# EAGLE design ld100v1 (EAGLE 9.6.2)
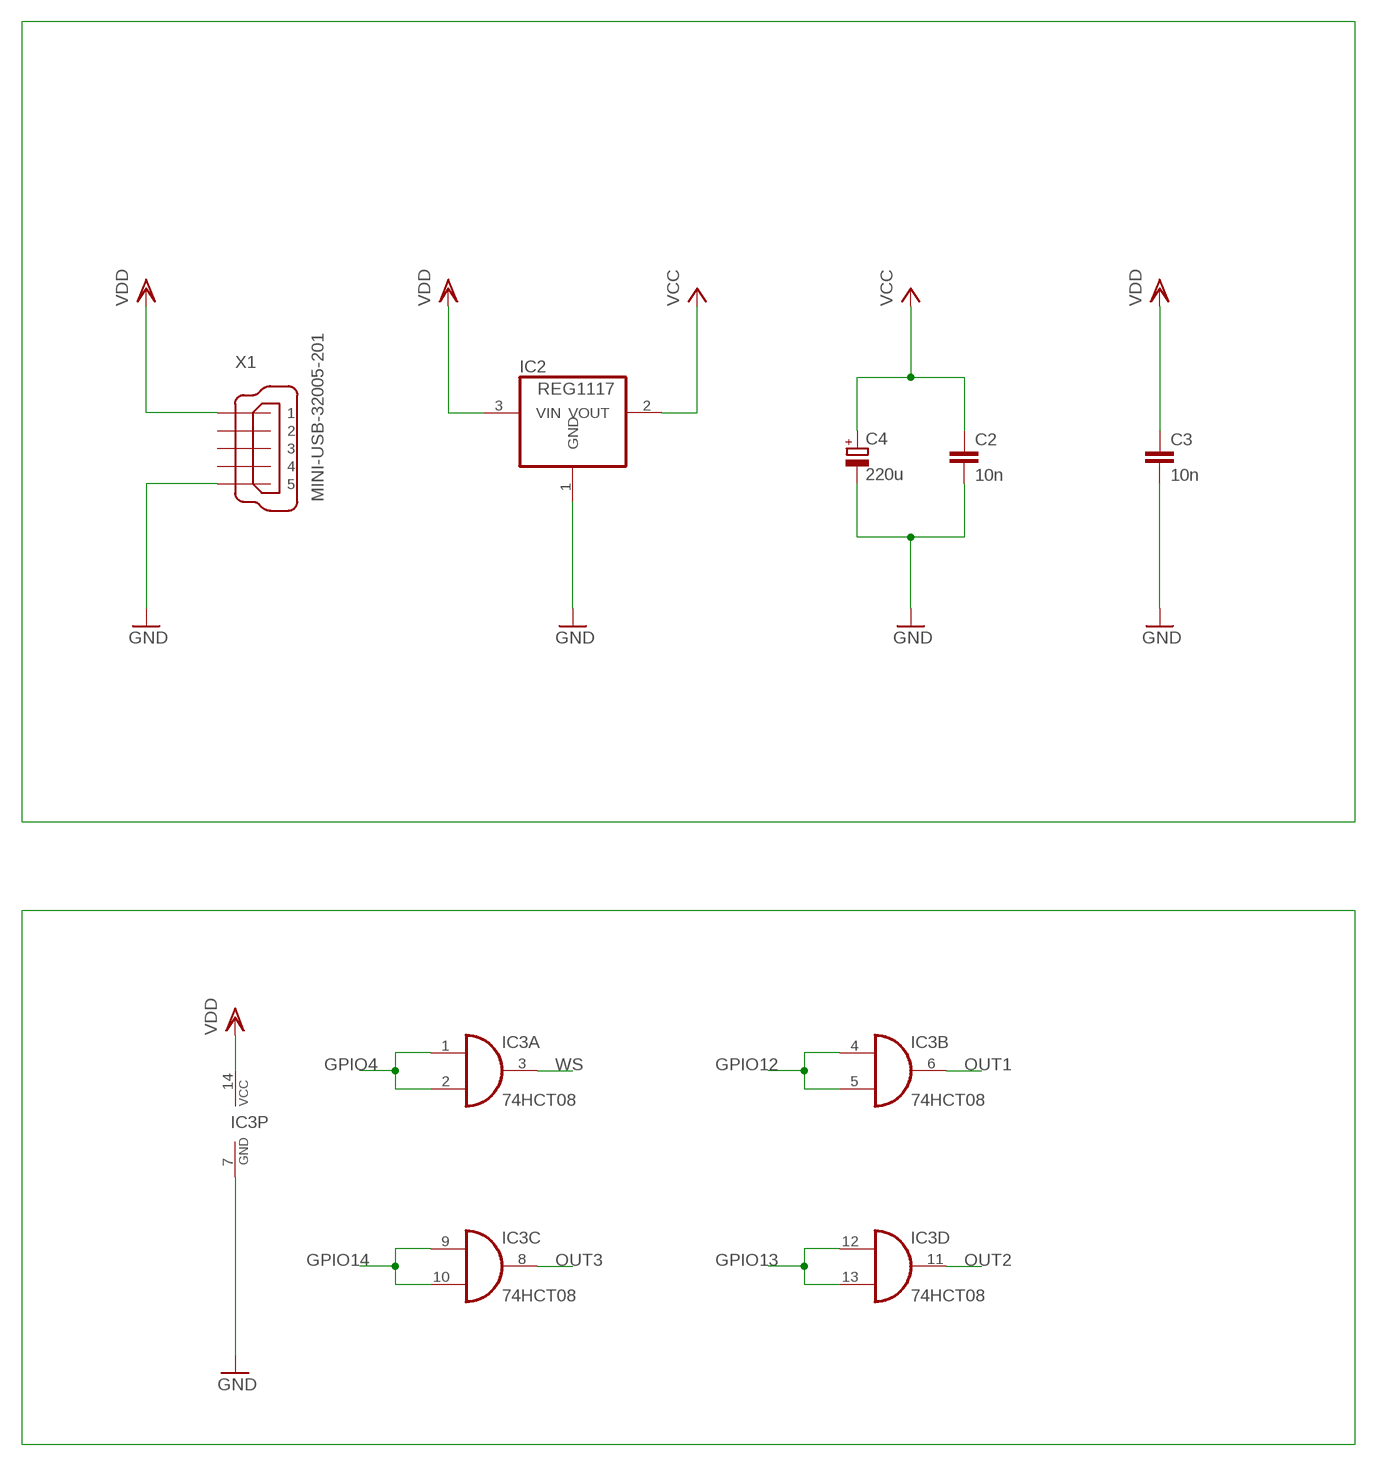
[diagram p0: schematic, sheet 1, part 1 of 2]
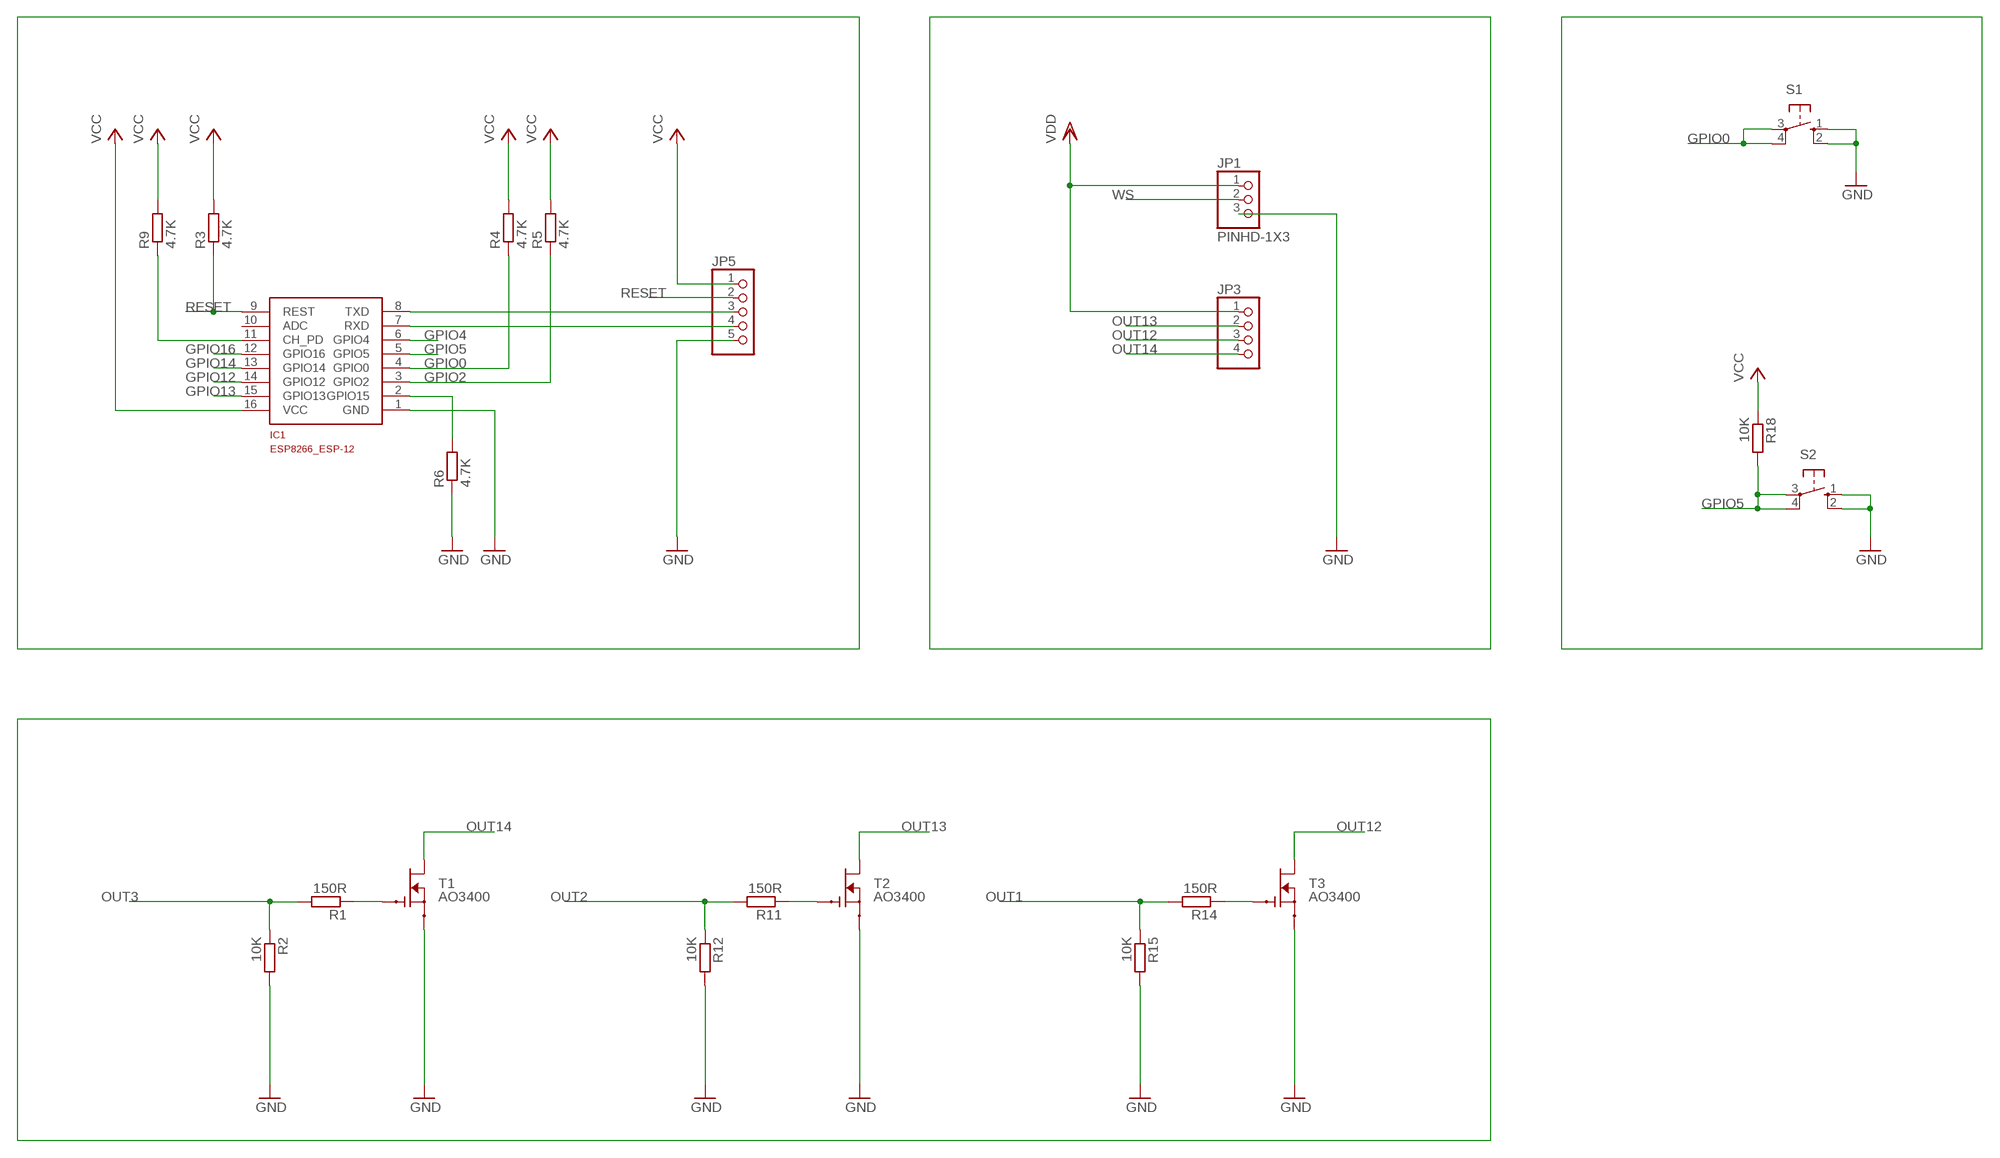
[diagram p1: schematic, sheet 1, part 2 of 2]

## Parts
C2  10n  C-EUC1206  [C1206]
C3  10n  C-EUC1206  [C1206]
C4  220u  CPOL-EUUD-6,3X8,8  [UD-6,3X5,8_NICHICON]
IC1  ESP8266_ESP-12  [ESP8266-ESP12]
IC2  REG1117  [SOT223]
IC3  74HCT08  74AC08D  [SO14]
JP1  PINHD-1X3  [1X03]
JP3  PINHD-1X4  [1X04]
JP5  PINHD-1X5  [1X05]
R1  150R  R-EU_R1206  [R1206]
R2  10K  R-EU_R1206  [R1206]
R3  4.7K  R-EU_R1206  [R1206]
R4  4.7K  R-EU_R1206  [R1206]
R5  4.7K  R-EU_R1206  [R1206]
R6  4.7K  R-EU_R1206  [R1206]
R9  4.7K  R-EU_R1206  [R1206]
R11  150R  R-EU_R1206  [R1206]
R12  10K  R-EU_R1206  [R1206]
R14  150R  R-EU_R1206  [R1206]
R15  10K  R-EU_R1206  [R1206]
R18  10K  R-EU_R1206  [R1206]
S1  10-XX  [B3F-10XX]
S2  10-XX  [B3F-10XX]
T1  AO3400  [SOT23]
T2  AO3400  [SOT23]
T3  AO3400  [SOT23]
X1  MINI-USB-32005-201  [32005-201]

## Nets
GND: C2.2 C3.2 C4.- IC1.1(GND) IC2.1(GND) IC3.7(P:GND) JP1.3 JP5.5 R2.2 R6.1 R12.2 R15.2 S1.1(S) S1.2(S1) S2.1(S) S2.2(S1) T1.2(S) T2.2(S) T3.2(S) X1.5
GPIO0: IC1.4(GPIO0) R4.1 S1.3(P) S1.4(P1)
GPIO2: IC1.3(GPIO2) R5.1
GPIO4: IC1.6(GPIO4) IC3.1(A:I0) IC3.2(A:I1)
GPIO5: IC1.5(GPIO5) R18.2 S2.3(P) S2.4(P1)
GPIO12: IC1.14(GPIO12) IC3.4(B:I0) IC3.5(B:I1)
GPIO13: IC1.15(GPIO13) IC3.12(D:I0) IC3.13(D:I1)
GPIO14: IC1.13(GPIO14) IC3.9(C:I0) IC3.10(C:I1)
GPIO16: IC1.12(GPIO16)
N$1: IC1.8(TXD) JP5.3
N$2: IC1.7(RXD) JP5.4
N$4: IC1.11(CH_PD) R9.1
N$6: IC1.2(GPIO15) R6.2
N$8: R1.1 T1.1(G)
N$11: R11.1 T2.1(G)
N$13: R14.1 T3.1(G)
OUT1: IC3.6(B:O) R14.2 R15.1
OUT2: IC3.11(D:O) R11.2 R12.1
OUT3: IC3.8(C:O) R1.2 R2.1
OUT12: JP3.3 T3.3(D)
OUT13: JP3.2 T2.3(D)
OUT14: JP3.4 T1.3(D)
RESET: IC1.9(REST) JP5.2 R3.1
VCC: C2.1 C4.+ IC1.16(VCC) IC2.2(VOUT) JP5.1 R3.2 R4.2 R5.2 R9.2 R18.1
VDD: C3.1 IC2.3(VIN) IC3.14(P:VCC) JP1.1 JP3.1 X1.1
WS: IC3.3(A:O) JP1.2
Unconnected: IC1.10(ADC) X1.2 X1.3 X1.4

## Library data of the parts
C2 C3 = rcl:C-EU: CAPACITOR, European symbol; SPICEPREFIX: C
C4 = rcl:CPOL-EU: POLARIZED CAPACITOR, European symbol; SPICEPREFIX: C
IC1 = ESP8266-ESP12:ESP8266_ESP-12
IC2 = burr-brown:REG1117: 800mA and 1A Low Dropout (LDO) Positive Regulator 1.8V, 2.5V, 2.85V, 3.3V, 5V, and Adj; MPN: REG1117; OC_FARNELL: 1097566; OC_NEWARK: 14P6981
IC3 = 74xx-eu:74*08: Quad 2-input AND gate
JP1 = Connector:PINHD-1X3: PIN HEADER; CATEGORY: CONNECTOR; SUB-CATEGORY: PIN-HEADER
JP3 = pinhead:PINHD-1X4: PIN HEADER
JP5 = pinhead:PINHD-1X5: PIN HEADER
R1-R6 R9 R11 R12 R14 R15 R18 = rcl:R-EU_: RESISTOR, European symbol; SPICEPREFIX: R
S1 S2 = switch-omron:10-XX: OMRON SWITCH; MPN: B3F-1000; OC_FARNELL: 176432; OC_NEWARK: 36M3542
T1-T3 = AO3400:AO3400; AVAILABILITY: Unavailable; DESCRIPTION: N-Channel 30V 5.8A _Ta_ 1.4W _Ta_ Surface Mount SOT-23-3; MF: Alpha &; MP: AO3400; PACKAGE: SOT-23-3 Alpha &amp; Omega Semiconductor; PRICE: None
X1 = con-cypressindustries:MINI-USB-: MINI USB-B Conector Source: www.cypressindustries.com; OC_FARNELL: unknown; OC_NEWARK: unknown

## Board
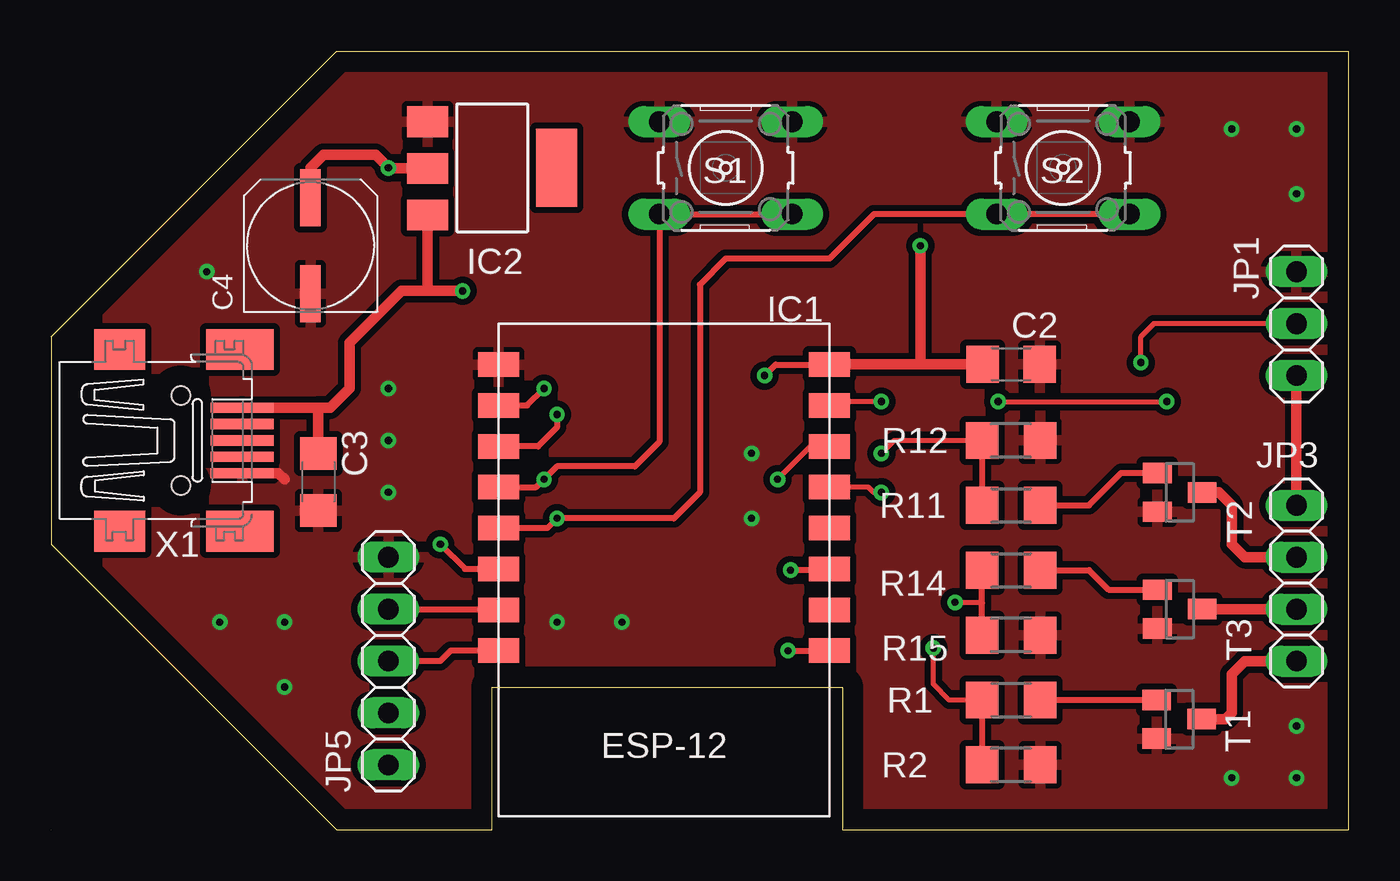
[diagram p2: board, top side]
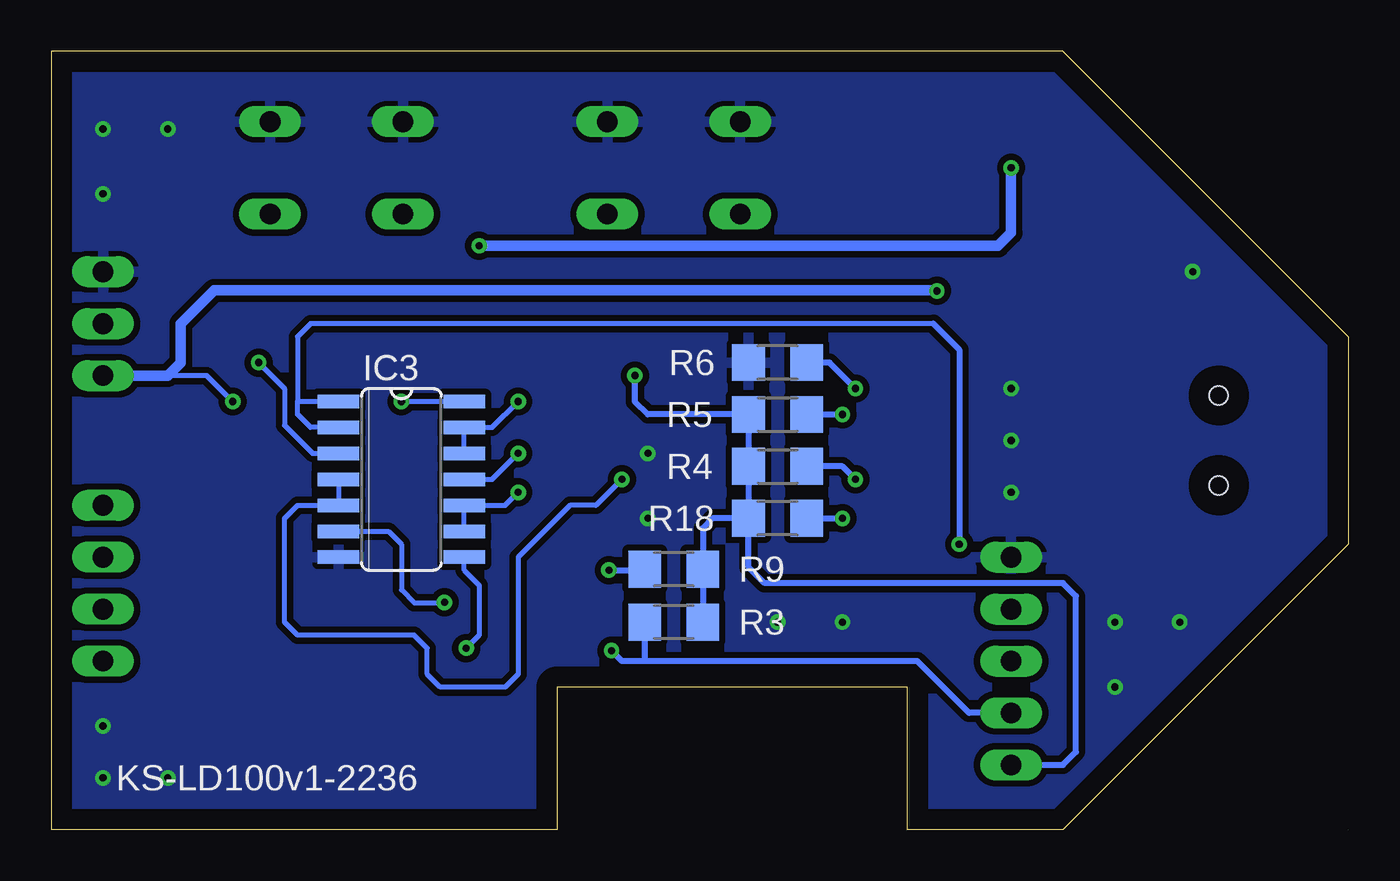
[diagram p3: board, bottom side, seen from below]

Size 63.5 x 38.1 mm. Coordinates in mm from the lower left corner, seen from the top.
Outline: 0,0 0.01,0
Outline: 0,24.13 0,13.97 13.97,0 21.59,0 21.59,6.99 38.73,6.99 38.73,0 63.5,0 63.5,38.1 13.97,38.1 0,24.13
Copper layers (1*16): Top 0.035mm / dielectric 1.5mm / Bottom 0.035mm
Design rules "default *": minimum track width 10mil, minimum drill 0.35mm, track to track 10mil, track to pad 10mil, pad to pad 10mil, via to via 10mil, smd to smd 10mil, copper to edge 40mil, drill to drill 12mil, minimum pad ring 10mil, minimum via ring 8mil, stop-mask expansion 4mil, vias tented up to drill 0mil, thermal gap 10mil

### Footprints (pad centres in the part's own frame; a part is rotated, then mirrored left to right if it is on the bottom)
C1206 = smd 1.6 x 1.8: 1 -1.4,0; 2 1.4,0
UD-6,3X5,8_NICHICON = smd 2.8 x 1: + 2.35,0; - -2.35,0
ESP8266-ESP12 = smd 2 x 1.2: 1 16.2,2; 2 16.2,4; 3 16.2,6; 4 16.2,8; 5 16.2,10; 6 16.2,12; 7 16.2,14; 8 16.2,16; 9 0,16; 10 0,14; 11 0,12; 12 0,10; 13 0,8; 14 0,6; 15 0,4; 16 0,2
SOT223 = smd 1.499 x 2.007: 1 -2.261,-3.15; 2 0.025,-3.15; 3 2.311,-3.15 | smd 3.81 x 2.007: 4 0,3.15
SO14 = smd 0.66 x 2.032: 1 -3.81,-3.073; 2 -2.54,-3.073; 3 -1.27,-3.073; 4 0,-3.073; 5 1.27,-3.073; 6 2.54,-3.073; 7 3.81,-3.073; 8 3.81,3.073; 9 2.54,3.073; 10 1.27,3.073; 11 0,3.073; 12 -1.27,3.073; 13 -2.54,3.073; 14 -3.81,3.073
1X03 = drill 1.016 long: 1 -2.54,0; 2 0,0; 3 2.54,0
1X04 = drill 1.016 long: 1 -3.81,0; 2 -1.27,0; 3 1.27,0; 4 3.81,0
1X05 = drill 1.016 long: 1 -5.08,0; 2 -2.54,0; 3 0,0; 4 2.54,0; 5 5.08,0
R1206 = smd 1.6 x 1.803: 1 -1.422,0; 2 1.422,0
B3F-10XX = drill 1.016 long: 1 -3.251,2.261; 2 3.251,2.261; 3 -3.251,-2.261; 4 3.251,-2.261
SOT23 = smd 1 x 1.4: 1 -0.95,-1.1; 2 0.95,-1.1; 3 0,1.1
32005-201 = smd 3.1 x 0.5: 1 3,1.6; 2 3,0.8; 3 3,0; 4 3,-0.8; 5 3,-1.6 | smd 2.5 x 2: M1 -3,-4.45; M2 -3,4.45 | smd 3.3 x 2: M3 2.9,4.45; M4 2.9,-4.45 | hole 0.9: 0,2.2; 0,-2.2

### Placement (x,y rotation side)
C2  46.99,22.78 0 top
C3  13.08,17.02 270 top
C4  12.7,28.57 90 top
IC1  38.1,24.77 180 top
IC2  21.59,32.38 270 top
IC3  46.35,17.14 270 bottom
JP1  60.96,24.77 90 top
JP3  60.96,12.06 270 top
JP5  16.51,8.26 90 top
R1  46.99,6.35 180 top
R2  46.99,3.17 0 top
R3  33.02,10.16 0 bottom
R4  27.94,17.78 180 bottom
R5  27.94,20.32 180 bottom
R6  27.94,22.86 0 bottom
R9  33.02,12.75 0 bottom
R11  46.99,15.88 180 top
R12  46.99,19.05 0 top
R14  46.99,12.7 180 top
R15  46.99,9.53 0 top
R18  27.94,15.24 0 bottom
S1  33.02,32.38 0 top
S2  49.53,32.38 0 top
T1  55.22,5.41 270 top
T2  55.24,16.51 270 top
T3  55.24,10.79 270 top
X1  6.35,19.05 0 top

### Tracks (layer width: path | path; a pad name or v marks a point on that pad's centre or on a via)
GND  (via drill 0.35)
  Top 0.508: X1.5 11.12,17.45 11.43,17.14
  other vias: 8.26,10.16 7.62,27.3 16.51,16.51 16.51,19.05 16.51,21.59 60.96,31.11 60.96,34.29 57.78,34.29 60.96,5.08 60.96,2.54 57.78,2.54 11.43,10.16 11.43,6.99 34.29,18.41 34.29,15.24 24.77,10.16 27.94,10.16
  pour Top (isolate 0.305): 62.87,37.47 62.87,0.64 39.37,0.64 39.37,7.62 20.95,7.62 20.95,0.64 13.97,0.64 0.64,13.97 0.64,14.61 0.64,24.13 13.97,37.47
  pour Bottom (isolate 0.305): 14.61,37.47 62.87,37.47 62.87,0.64 39.37,0.64 39.37,7.62 20.95,7.62 20.95,0.64 13.97,0.64 0.64,13.97 0.64,23.5
GPIO0  (via drill 0.35)
  Top 0.305: S1.4 S1.3 29.77,18.97 28.57,17.78 24.77,17.78 v24.13,17.14 23.75,16.77 IC1.4
  Bottom 0.305: v24.13,17.14 24.77,17.78 R4.1
GPIO2  (via drill 0.35)
  Top 0.305: v24.77,20.32 24.77,19.68 23.84,18.77 IC1.3
  Bottom 0.305: R5.1 v24.77,20.32
GPIO4  (via drill 0.35)
  Top 0.305: v19.05,13.97 20.25,12.77 IC1.6
  Bottom 0.254: IC3.2 50.8,19.68 51.44,20.32 51.44,20.95 | IC3.1 51.44,20.95 | 20.32,24.77 50.8,24.77 51.44,24.13 51.44,20.95
  Bottom 0.305: 20.32,24.77 19.05,23.5 v19.05,13.97
GPIO5  (via drill 0.35)
  Top 0.305: S2.4 S2.3 40.28,30.12 38.1,27.94 33.02,27.94 31.75,26.67 31.75,16.51 30.48,15.24 v24.77,15.24 24.29,14.77 IC1.5
  Bottom 0.305: R18.2 v24.77,15.24
GPIO12  (via drill 0.35)
  Top 0.254: IC1.14 37.18,18.77 v35.56,17.14
  Bottom 0.254: IC3.4 IC3.5 51.44,15.88 52.07,15.24 52.07,10.16 51.44,9.53 45.72,9.53 45.09,8.89 45.09,7.62 44.45,6.99 41.27,6.99 40.64,7.62 40.64,13.34 38.1,15.88 36.83,15.88 v35.56,17.14
GPIO13  (via drill 0.35)
  Top 0.254: v40.64,20.95 38.29,20.95 IC1.15
  Bottom 0.254: IC3.12 IC3.13 41.91,19.68 v40.64,20.95
GPIO14  (via drill 0.35)
  Top 0.254: v40.64,16.51 40.26,16.51 40.01,16.77 IC1.13
  Bottom 0.254: IC3.9 IC3.10 41.27,15.88 v40.64,16.51
N$1
  Top 0.305: IC1.8 19.56,8.77 19.05,8.26 JP5.3
N$2
  Top 0.305: JP5.4 21.87,10.79 IC1.7
N$4  (via drill 0.35)
  Top 0.305: IC1.11 38.03,12.7 v36.2,12.7
  Bottom 0.305: v36.2,12.7 34.49,12.7 R9.1
N$6  (via drill 0.35)
  Top 0.305: IC1.2 23.3,20.77 v24.13,21.59
  Bottom 0.305: v24.13,21.59 25.4,22.86 R6.2
N$8
  Top 0.305: R1.1 48.42,6.36 T1.1
N$11
  Top 0.305: R11.1 50.8,15.88 52.38,17.46 T2.1
N$13
  Top 0.305: R14.1 50.8,12.7 51.76,11.74 T3.1
OUT1  (via drill 0.35)
  Top 0.254: v44.25,11.12 45.54,11.12 45.57,11.1
  Top 0.305: R15.1 45.57,11.1 R14.2
  Bottom 0.254: IC3.6 46.99,14.61 46.35,13.97 46.35,11.73 45.72,11.1 44.25,11.1 v44.25,11.12
OUT2  (via drill 0.35)
  Top 0.254: v40.64,18.41 41.27,19.05 R12.1
  Top 0.305: R12.1 R11.2
  Bottom 0.254: IC3.11 41.91,17.14 v40.64,18.41
OUT3  (via drill 0.35)
  Top 0.254: R1.2 43.97,6.35 43.18,7.14 v43.18,8.89
  Top 0.305: R1.2 R2.1
  Bottom 0.254: v43.18,8.89 42.55,9.53 42.55,11.96 43.28,12.7 IC3.8
OUT12
  Top 0.508: T3.3 JP3.3
OUT13
  Top 0.508: T2.3 57.15,16.51 57.78,15.88 57.78,13.97 58.42,13.34 JP3.2
OUT14
  Top 0.508: T1.3 57.48,5.41 57.78,5.71 57.78,7.62 58.42,8.26 JP3.4
RESET  (via drill 0.35)
  Top 0.305: v36.07,8.76 v36.07,8.77 IC1.9
  Bottom 0.305: JP5.2 18.57,5.71 21.11,8.26 34.49,8.26 | 34.49,8.26 35.56,8.26 v36.07,8.76 | R3.1 34.44,8.31 34.49,8.26
VCC  (via drill 0.35)
  Top 0.305: v34.92,22.23 35.47,22.77 IC1.16
  Top 0.508: IC1.16 38.12,22.78 42.55,22.78 | 42.55,22.78 C2.1 | 42.55,22.78 v42.55,28.57 | IC2.2 16.54,32.36 v16.51,32.38 15.88,33.02 13.34,33.02 12.7,32.38 C4.+
  Bottom 0.305: R18.1 R4.2 R5.2 34.29,20.32 34.92,20.95 v34.92,22.23 | R3.2 R9.2 31.6,14.76 31.11,15.24 R18.1 | JP5.1 13.97,3.17 13.34,3.81 13.34,11.43 13.97,12.06 28.57,12.06 29.36,12.85 R18.1
  Bottom 0.508: v42.55,28.57 17.14,28.57 16.51,29.21 v16.51,32.38
VDD  (via drill 0.35)
  Top 0.254: v46.35,20.95 v54.61,20.95
  Top 0.508: X1.1 13.08,20.65 | 13.08,20.65 13.66,20.65 14.61,21.59 14.61,23.82 17.15,26.36 18.41,26.36 | JP1.1 JP3.1 | 18.41,26.36 v20.14,26.36 | IC2.3 18.44,26.39 18.41,26.36 | C3.1 13.08,20.65
  Bottom 0.254: IC3.14 v46.35,20.95 | v54.61,20.95 55.88,22.23 57.78,22.23
  Bottom 0.508: v20.14,26.36 20.17,26.39 55.52,26.39 57.15,24.77 57.15,22.86 57.78,22.23 JP1.1
WS  (via drill 0.35)
  Top 0.254: v53.34,22.86 53.34,24.13 53.98,24.77 JP1.2
  Bottom 0.254: v53.34,22.86 52.07,21.59 52.07,19.79 50.7,18.41 IC3.3

### Text on the board
bNames: KS-LD100v1-2236